# EAGLE schematic LogicSlice (EAGLE 6.5.0)
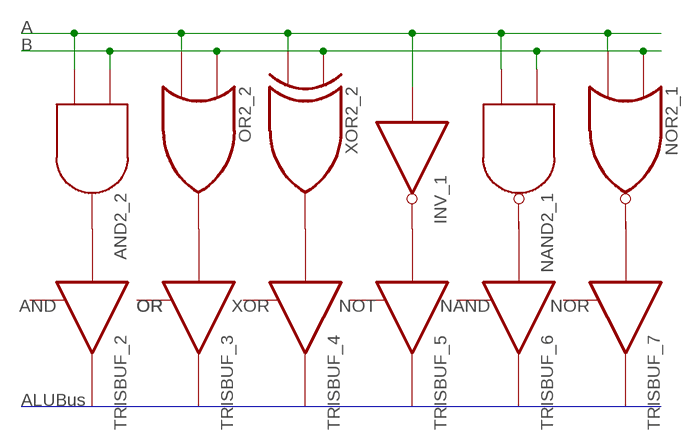
[diagram p0: schematic, sheet 1]

## Parts
AND2_2  AND2  [3PIN]
INV_1  INV  [3PIN]
NAND2_1  NAND2  [3PIN]
NOR2_1  NOR2  [3PIN]
OR2_2  OR2  [3PIN]
TRISBUF_2  TRISBUF  [3PIN]
TRISBUF_3  TRISBUF  [3PIN]
TRISBUF_4  TRISBUF  [3PIN]
TRISBUF_5  TRISBUF  [3PIN]
TRISBUF_6  TRISBUF  [3PIN]
TRISBUF_7  TRISBUF  [3PIN]
XOR2_2  XOR2  [3PIN]

## Nets
N$1: AND2_2.P$3(O) TRISBUF_2.P$1(I)
N$2: OR2_2.P$3(O) TRISBUF_3.P$1(I)
N$3: TRISBUF_4.P$1(I) XOR2_2.P$3(O)
N$4: INV_1.P$2(O) TRISBUF_5.P$1(I)
N$5: NAND2_1.P$3(O) TRISBUF_6.P$1(I)
N$6: NOR2_1.P$3(O) TRISBUF_7.P$1(I)
N$9: AND2_2.P$1(A) AND2_2.P$2(I1) INV_1.P$1(I) NAND2_1.P$1(A) NAND2_1.P$2(I1) NOR2_1.P$1(I0) NOR2_1.P$2(I1) OR2_2.P$1(I0) OR2_2.P$2(I1) XOR2_2.P$1(I0) XOR2_2.P$2(I1)
Unconnected: TRISBUF_2.P$2(O) TRISBUF_2.P$3 TRISBUF_3.P$2(O) TRISBUF_3.P$3 TRISBUF_4.P$2(O) TRISBUF_4.P$3 TRISBUF_5.P$2(O) TRISBUF_5.P$3 TRISBUF_6.P$2(O) TRISBUF_6.P$3 TRISBUF_7.P$2(O) TRISBUF_7.P$3

## Buses
B$1

## Notes on the sheet
- A
- B
- AND | OR | OR | XOR | NOT | NAND | NOR
- ALUBus

## Library data of the parts
AND2_2 = c035u:AND2
INV_1 = c035u:INV
NAND2_1 = c035u:NAND2
NOR2_1 = c035u:NOR2
OR2_2 = c035u:OR2
TRISBUF_2-TRISBUF_7 = c035u:TRISBUF
XOR2_2 = c035u:XOR2